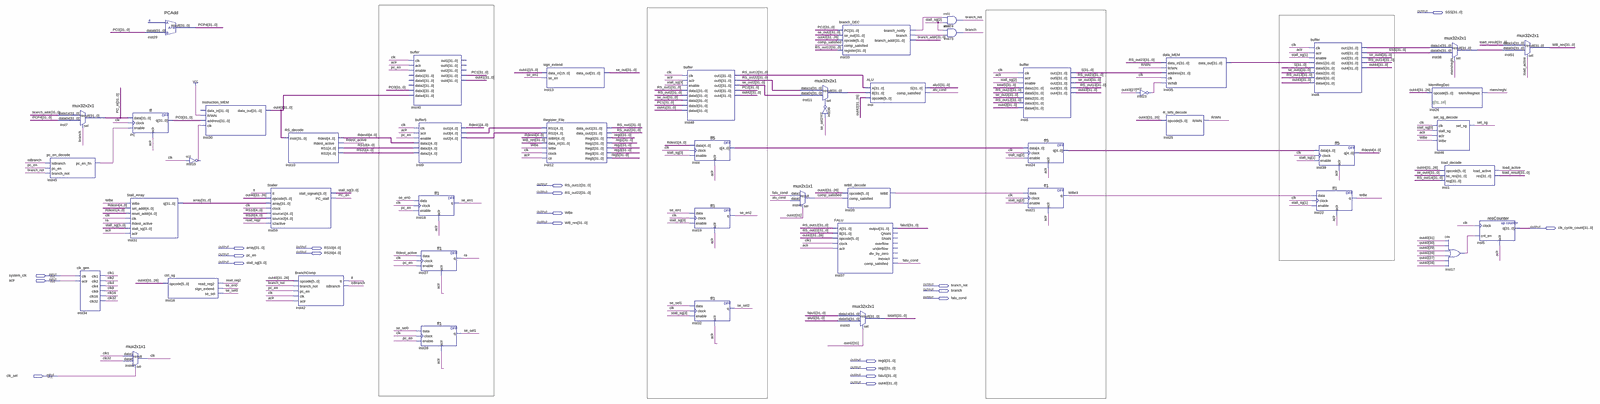
[diagram p0: schematic sheet, whole]
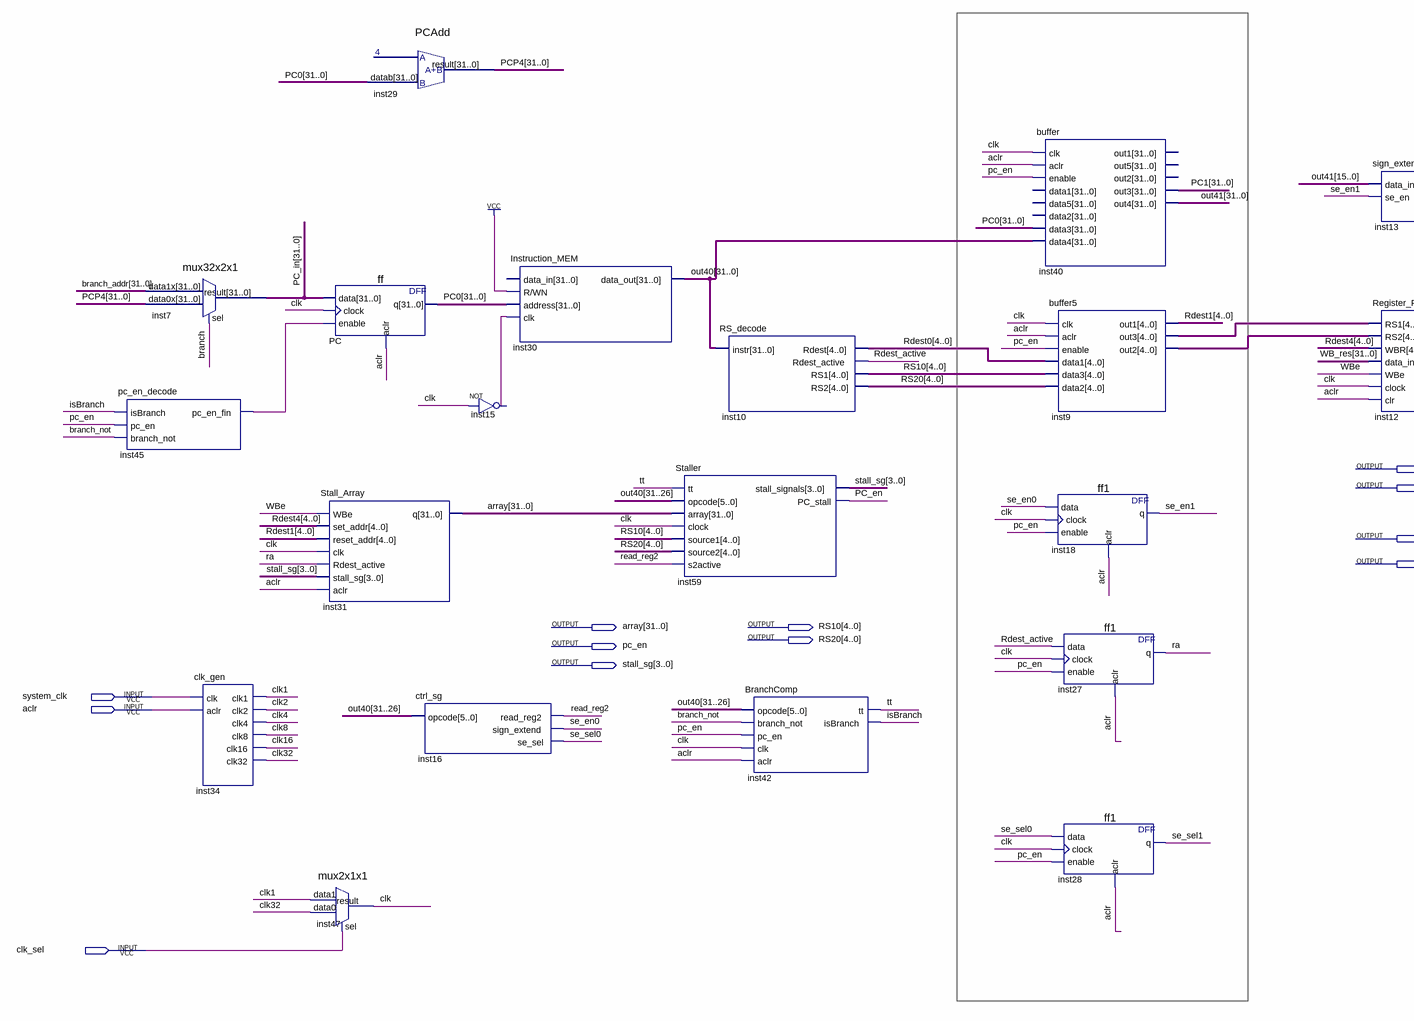
[diagram p1: schematic sheet, left part]
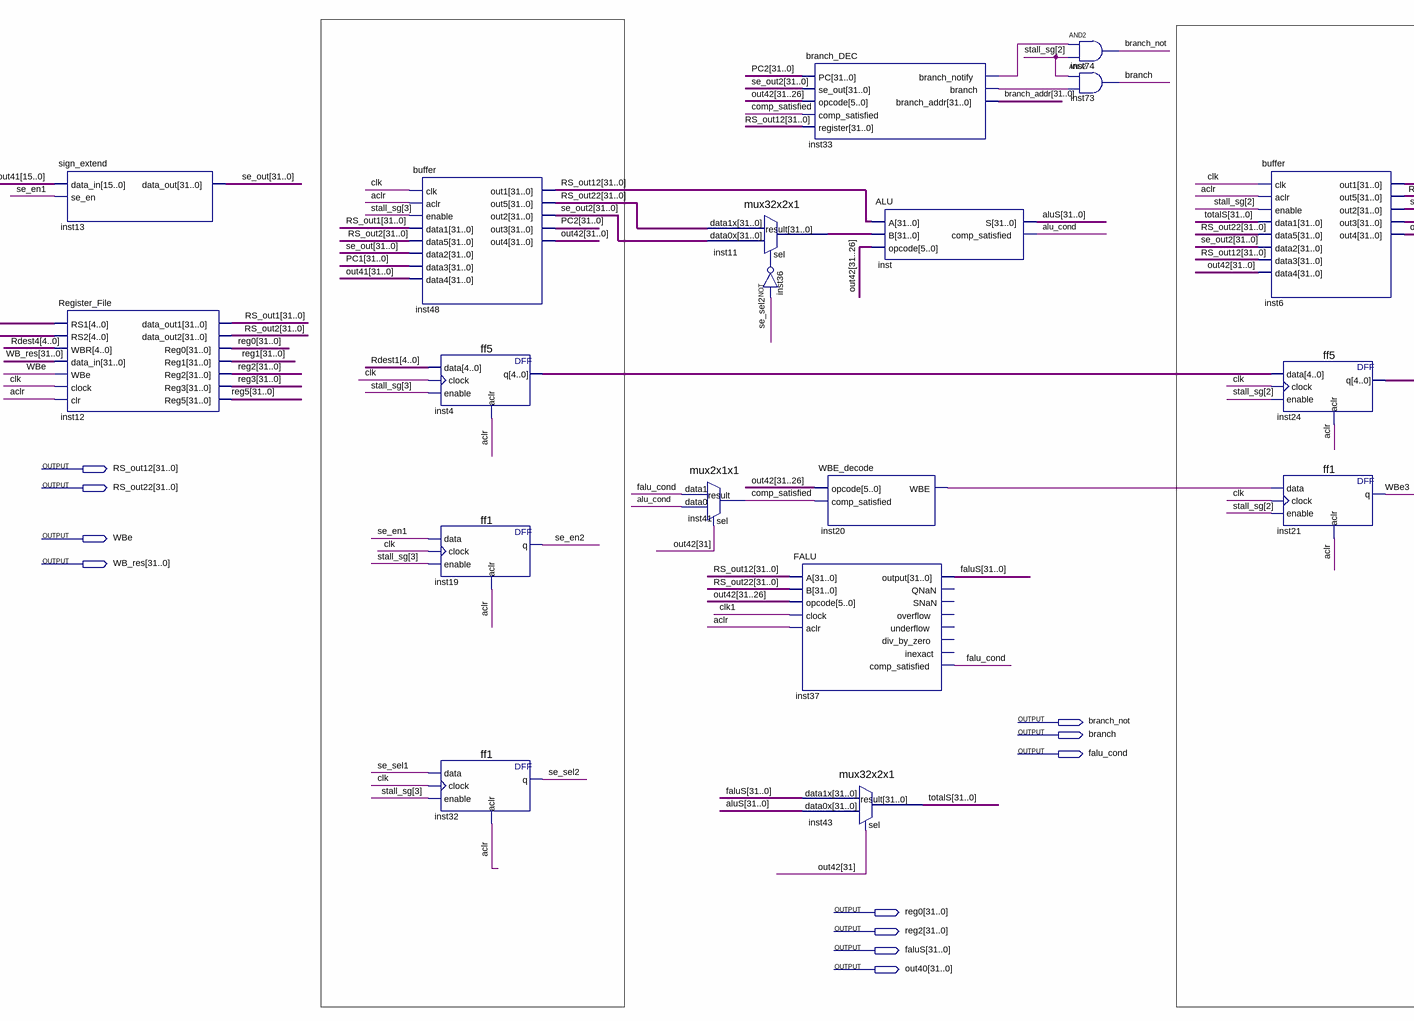
[diagram p2: schematic sheet, centre part]
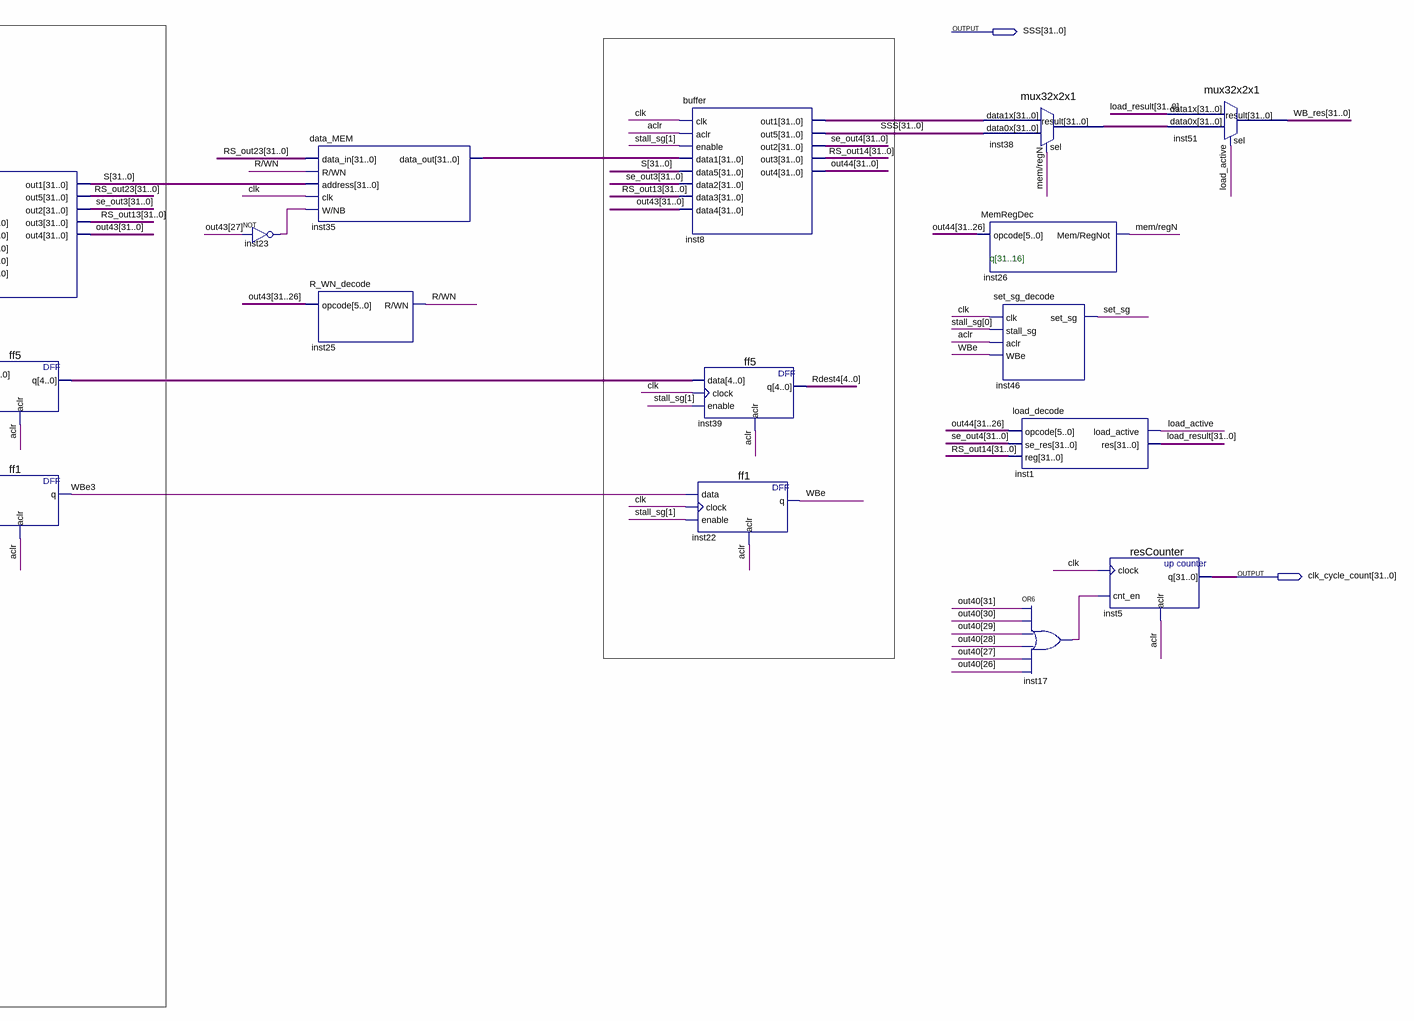
[diagram p3: schematic sheet, right part]
// Quartus schematic CAP.bdf as structural Verilog: 50 symbols, 21 pins
module CAP (
  input  system_clk,
  input  aclr,
  input  clk_sel,
  output [31:0] SSS,
  output [31:0] RS_out12,
  output [31:0] RS_out22,
  output WBe,
  output [31:0] WB_res,
  output [31:0] clk_cycle_count,
  output [31:0] array,
  output [4:0] RS10,
  output [4:0] RS20,
  output pc_en,
  output [3:0] stall_sg,
  output branch_not,
  output branch,
  output falu_cond,
  output [31:0] reg0,
  output [31:0] reg2,
  output [31:0] faluS,
  output [31:0] out40
);

  wire alu_cond, clk, clk1, clk2, clk4, clk8, clk16, clk32, comp_satisfied, inst15_out, inst17_out,
       inst20_wbe, inst23_out, inst33_branch, inst33_branch_notify, inst36_out, inst45_pc_en_fin, isBranch,
       load_active, \mem/regN , \R/WN , ra, Rdest_active, read_reg2, se_en0, se_en1, se_en2, se_sel0,
       se_sel1, se_sel2, set_sg, tt, WBe3;
  wire [4:0] inst4_q, inst9_out2, inst9_out3, inst24_q, Rdest0, Rdest1, Rdest4;
  wire [31:0] aluS, branch_addr, inst8_out1, inst11_result, inst35_data_out, inst38_result, load_result,
       out41, out42, out43, out44, PC0, PC1, PC2, PC_in, PCP4, reg1, reg3, reg5, RS_out1, RS_out2, RS_out13,
       RS_out14, RS_out23, S, se_out, se_out2, se_out3, se_out4, totalS;

  mux32x2x1 inst7 (.data1x(branch_addr), .data0x(PCP4), .sel(branch), .result(PC_in));
  pc_en_decode inst45 (.isBranch(isBranch), .pc_en(pc_en), .branch_not(branch_not), .pc_en_fin(inst45_pc_en_fin));
  clk_gen inst34 (
    .clk(system_clk), .aclr(aclr), .clk1(clk1), .clk2(clk2), .clk4(clk4), .clk8(clk8), .clk16(clk16),
    .clk32(clk32));
  mux2x1x1 inst47 (.data1(clk1), .data0(clk32), .sel(clk_sel), .result(clk));
  ff PC (.data(PC_in), .clock(clk), .enable(inst45_pc_en_fin), .aclr(aclr), .q(PC0));
  Stall_Array inst31 (
    .WBe(WBe), .set_addr(Rdest4), .reset_addr(Rdest1), .clk(clk), .Rdest_active(ra), .stall_sg(stall_sg),
    .aclr(aclr), .q(array));
  PCAdd inst29 (.datab(PC0), .result(PCP4));
  ctrl_sg inst16 (.opcode(out40[31:26]), .read_reg2(read_reg2), .sign_extend(se_en0), .se_sel(se_sel0));
  Instruction_MEM inst30 (.\R/WN (1'b1), .address(PC0), .clk(inst15_out), .data_out(out40));  // open: data_in
  not inst15 (inst15_out, clk);
  RS_decode inst10 (.instr(out40), .Rdest(Rdest0), .Rdest_active(Rdest_active), .RS1(RS10), .RS2(RS20));
  Staller inst59 (
    .tt(tt), .opcode(out40[31:26]), .array(array), .clock(clk), .source1(RS10), .source2(RS20),
    .s2active(read_reg2), .stall_signals(stall_sg), .PC_stall(pc_en));
  BranchComp inst42 (
    .opcode(out40[31:26]), .branch_not(branch_not), .pc_en(pc_en), .clk(clk), .aclr(aclr), .tt(tt),
    .isBranch(isBranch));
  buffer inst40 (
    .clk(clk), .aclr(aclr), .enable(pc_en), .data3(PC0), .data4(out40), .out3(PC1), .out4(out41));  // open: data1, data5, data2, out1, out5, out2
  buffer5 inst9 (
    .clk(clk), .aclr(aclr), .enable(pc_en), .data1(Rdest0), .data3(RS10), .data2(RS20), .out1(Rdest1),
    .out3(inst9_out3), .out2(inst9_out2));
  ff1 inst18 (.data(se_en0), .clock(clk), .enable(pc_en), .aclr(aclr), .q(se_en1));
  ff1 inst27 (.data(Rdest_active), .clock(clk), .enable(pc_en), .aclr(aclr), .q(ra));
  ff1 inst28 (.data(se_sel0), .clock(clk), .enable(pc_en), .aclr(aclr), .q(se_sel1));
  sign_extend inst13 (.data_in(out41[15:0]), .se_en(se_en1), .data_out(se_out));
  Register_File inst12 (
    .RS1(inst9_out3), .RS2(inst9_out2), .WBR(Rdest4), .data_in(WB_res), .WBe(WBe), .clock(clk), .clr(aclr),
    .data_out1(RS_out1), .data_out2(RS_out2), .Reg0(reg0), .Reg1(reg1), .Reg2(reg2), .Reg3(reg3), .Reg5(reg5));
  buffer inst48 (
    .clk(clk), .aclr(aclr), .enable(stall_sg[3]), .data1(RS_out1), .data5(RS_out2), .data2(se_out),
    .data3(PC1), .data4(out41), .out1(RS_out12), .out5(RS_out22), .out2(se_out2), .out3(PC2), .out4(out42));
  ff5 inst4 (.data(Rdest1), .clock(clk), .enable(stall_sg[3]), .aclr(aclr), .q(inst4_q));
  ff1 inst19 (.data(se_en1), .clock(clk), .enable(stall_sg[3]), .aclr(aclr), .q(se_en2));
  ff1 inst32 (.data(se_sel1), .clock(clk), .enable(stall_sg[3]), .aclr(aclr), .q(se_sel2));
  mux32x2x1 inst11 (.data1x(RS_out22), .data0x(se_out2), .sel(inst36_out), .result(inst11_result));
  mux2x1x1 inst41 (.data1(falu_cond), .data0(alu_cond), .sel(out42[31]), .result(comp_satisfied));
  not inst36 (inst36_out, se_sel2);
  branch_DEC inst33 (
    .PC(PC2), .se_out(se_out2), .opcode(out42[31:26]), .comp_satisfied(comp_satisfied), .register(RS_out12),
    .branch_notify(inst33_branch_notify), .branch(inst33_branch), .branch_addr(branch_addr));
  WBE_decode inst20 (.opcode(out42[31:26]), .comp_satisfied(comp_satisfied), .WBE(inst20_wbe));
  FALU inst37 (
    .A(RS_out12), .B(RS_out22), .opcode(out42[31:26]), .clock(clk1), .aclr(aclr), .\output (faluS),
    .comp_satisfied(falu_cond));  // open: QNaN, SNaN, overflow, underflow, div_by_zero, inexact
  mux32x2x1 inst43 (.data1x(faluS), .data0x(aluS), .sel(out42[31]), .result(totalS));
  ALU inst (.A(RS_out12), .B(inst11_result), .opcode(out42[31:26]), .S(aluS), .comp_satisfied(alu_cond));
  and inst74 (branch_not, inst33_branch_notify, stall_sg[2]);
  and inst73 (branch, stall_sg[2], inst33_branch);
  buffer inst6 (
    .clk(clk), .aclr(aclr), .enable(stall_sg[2]), .data1(totalS), .data5(RS_out22), .data2(se_out2),
    .data3(RS_out12), .data4(out42), .out1(S), .out5(RS_out23), .out2(se_out3), .out3(RS_out13), .out4(out43));
  ff5 inst24 (.data(inst4_q), .clock(clk), .enable(stall_sg[2]), .aclr(aclr), .q(inst24_q));
  ff1 inst21 (.data(inst20_wbe), .clock(clk), .enable(stall_sg[2]), .aclr(aclr), .q(WBe3));
  not inst23 (inst23_out, out43[27]);
  data_MEM inst35 (
    .data_in(RS_out23), .\R/WN (\R/WN ), .address(S), .clk(clk), .\W/NB (inst23_out),
    .data_out(inst35_data_out));
  R_WN_decode inst25 (.opcode(out43[31:26]), .\R/WN (\R/WN ));
  buffer inst8 (
    .clk(clk), .aclr(aclr), .enable(stall_sg[1]), .data1(inst35_data_out), .data5(S), .data2(se_out3),
    .data3(RS_out13), .data4(out43), .out1(inst8_out1), .out5(SSS), .out2(se_out4), .out3(RS_out14),
    .out4(out44));
  ff5 inst39 (.data(inst24_q), .clock(clk), .enable(stall_sg[1]), .aclr(aclr), .q(Rdest4));
  ff1 inst22 (.data(WBe3), .clock(clk), .enable(stall_sg[1]), .aclr(aclr), .q(WBe));
  MemRegDec inst26 (.opcode(out44[31:26]), .\Mem/RegNot (\mem/regN ));
  mux32x2x1 inst38 (.data1x(inst8_out1), .data0x(SSS), .sel(\mem/regN ), .result(inst38_result));
  set_sg_decode inst46 (.clk(clk), .stall_sg(stall_sg[0]), .aclr(aclr), .WBe(WBe), .set_sg(set_sg));
  load_decode inst1 (
    .opcode(out44[31:26]), .se_res(se_out4), .\reg (RS_out14), .load_active(load_active), .res(load_result));
  or inst17 (inst17_out, out40[31], out40[30], out40[29], out40[28], out40[27], out40[26]);
  resCounter inst5 (.clock(clk), .cnt_en(inst17_out), .aclr(aclr), .q(clk_cycle_count));
  mux32x2x1 inst51 (.data1x(load_result), .data0x(inst38_result), .sel(load_active), .result(WB_res));

  // Notes on the sheet:
  //   q[31..16]
endmodule
